# EasyEDA Pro project usb-hub.eprj

# Schematic Schematic1
Board Name: Board1; Create Date: 2026-05-12; Page Name: P1; Project Name: usb-hub; Schematic Name: Schematic1; Update Date: 2026-05-13; Company: EasyEDA.com; Page Size: A4; Version: V1.0
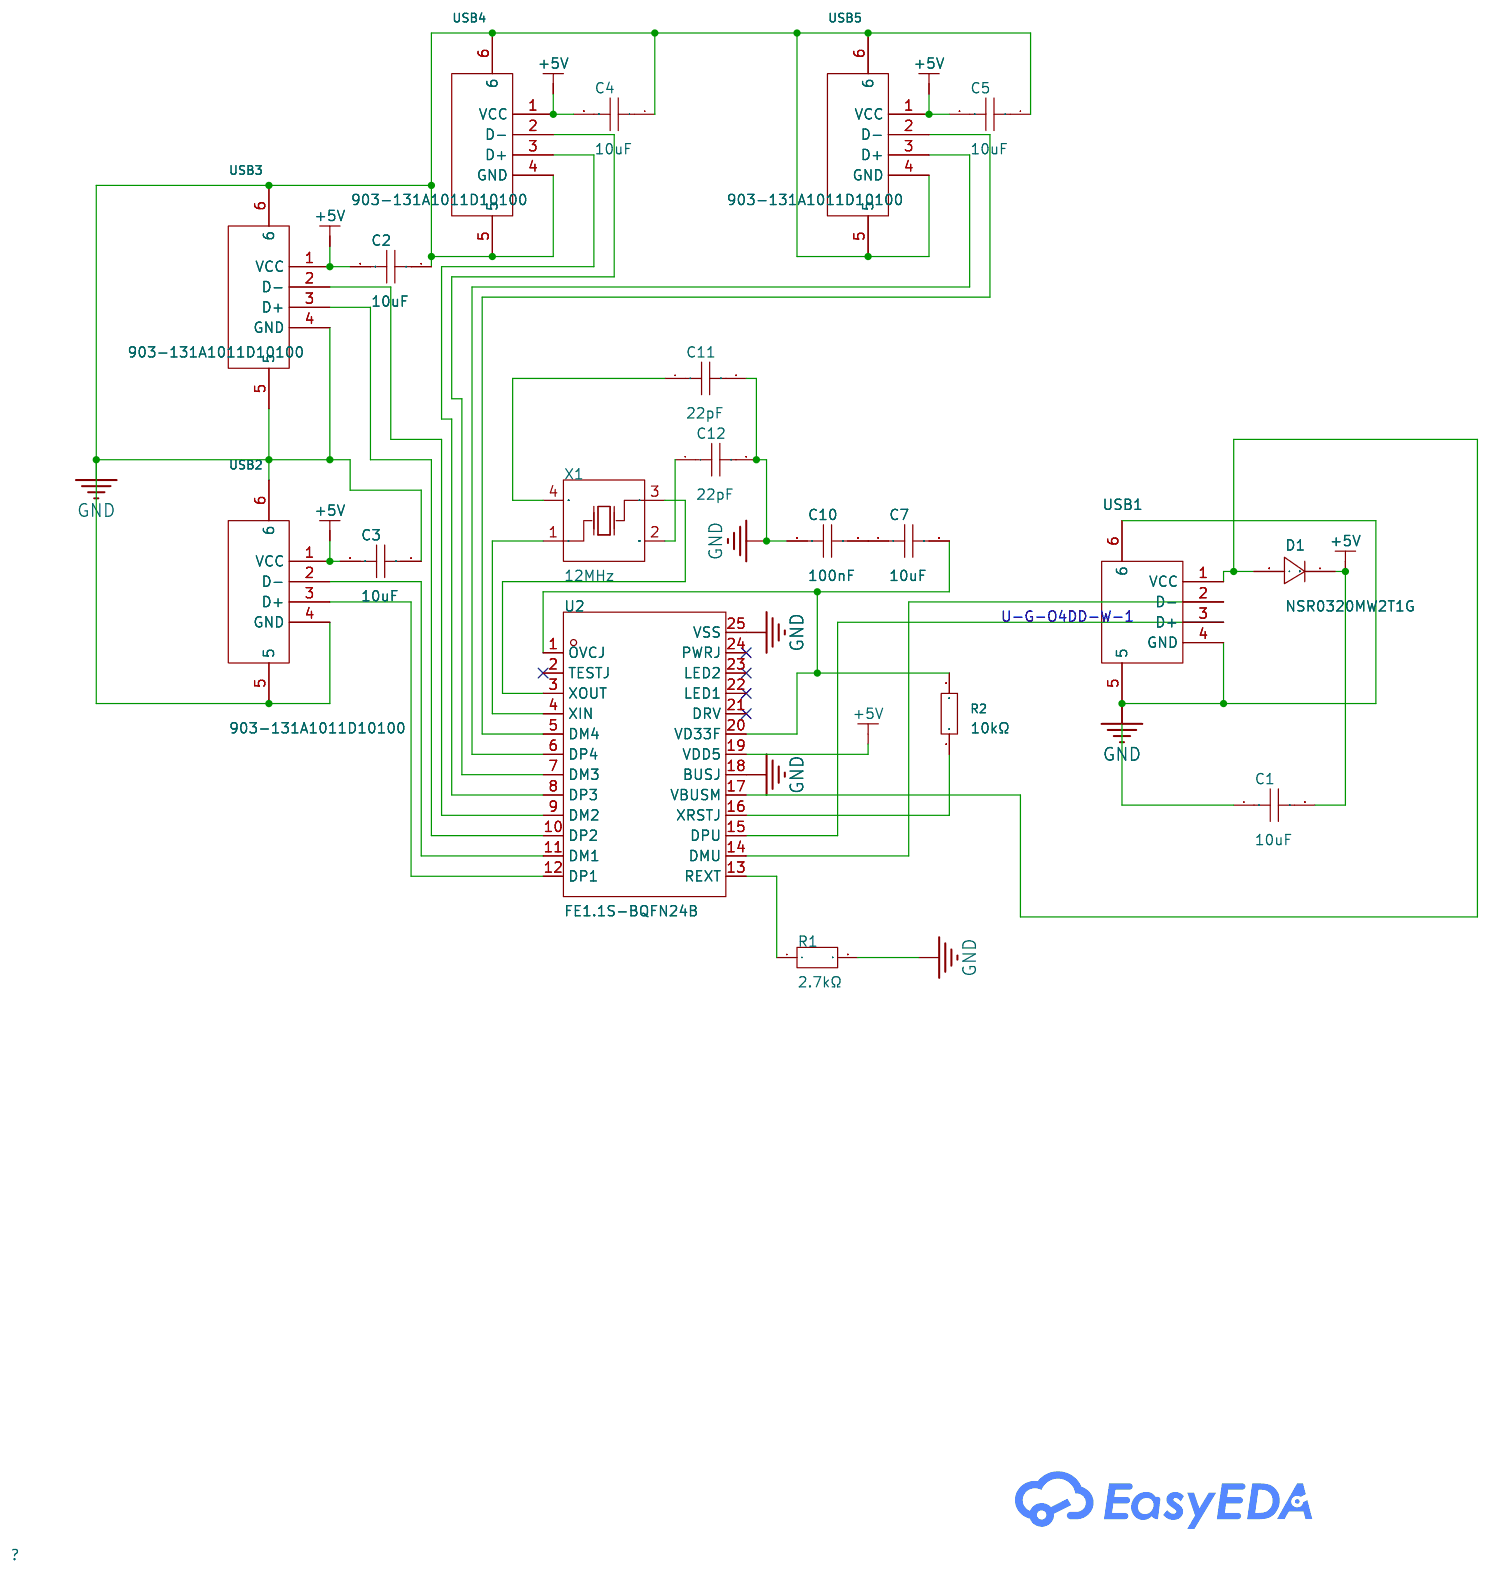
[diagram p0: schematic sheet]

## Parts
C1  10uF  [C0603]
C2  10uF  [C0603]
C3  10uF  [C0603]
C4  10uF  [C0603]
C5  10uF  [C0603]
C7  10uF  [C0603]
C10  100nF  [C0402]
C11  22pF  [CAP-TH_L4.8-W3.2-P5.08-D0.5]
C12  22pF  [CAP-TH_L4.8-W3.2-P5.08-D0.5]
D1  NSR0320MW2T1G  [SOD-323_L1.8-W1.3-LS2.5-RD]
R1  2.7kΩ  [RES-TH_BD1.8-L3.2-P7.20-D0.4]
R2  10kΩ  [R1206]
U2  FE1.1S-BQFN24B  [WQFN-24_L4.0-W4.0-P0.50-TL-EP2.7]
USB1  U-G-O4DD-W-1  [USB-A-TH_U-G-04WD-W-01]
USB2  903-131A1011D10100  [USB-A-TH_C46407]
USB3  903-131A1011D10100  [USB-A-TH_C46407]
USB4  903-131A1011D10100  [USB-A-TH_C46407]
USB5  903-131A1011D10100  [USB-A-TH_C46407]
X1  12MHz  [OSC-SMD_4P-L7.0-W5.0-BL]

## Library data of the parts
C1-C5 C7 = CL10A106KP8NNNC: LCSC Part Name: 10uF ±10% 10V; Supplier Part: C19702; Manufacturer: SAMSUNG(三星); Supplier Footprint: 0603; JLCPCB Part Class: Basic Part; Datasheet: https://item.szlcsc.com/datasheet/CL10A106KP8NNNC/20411.html; Supplier: LCSC; Tolerance: ±10%; Voltage Rating: 10V; Temperature Coefficient: X5R
C10 = CL05B104KO5NNNC: LCSC Part Name: 100nF ±10% 16V; Supplier Part: C1525; Manufacturer: SAMSUNG(三星); Supplier Footprint: 0402; JLCPCB Part Class: Basic Part; Datasheet: https://item.szlcsc.com/datasheet/CL05B104KO5NNNC/1877.html; Supplier: LCSC; Tolerance: ±10%; Voltage Rating: 16V; Temperature Coefficient: X7R
C11 C12 = CC4-0805-CG-50V-22pF-J: LCSC Part Name: 22pF ±5% 50V; Supplier Part: C123150; Manufacturer: TORCH(火炬); Supplier Footprint: 插件,P=5.08mm; JLCPCB Part Class: Extended Part; Datasheet: https://item.szlcsc.com/datasheet/CC4-0805-CG-50V-22pF-J/124420.html; Supplier: LCSC; Tolerance: ±5%; Voltage Rating: 50V
D1 = NSR0320MW2T1G: LCSC Part Name: 电压:20V 电流:1A; Supplier Part: C48192; Manufacturer: onsemi(安森美); Supplier Footprint: SOD-323; JLCPCB Part Class: Extended Part; Datasheet: https://item.szlcsc.com/datasheet/NSR0320MW2T1G/49199.html; Supplier: LCSC; Voltage - Forward(Vf@If): 500mV@900mA; Voltage - DC Reverse(Vr): 20V; Current - Rectified: 1A; Reverse Leakage Current (Ir): 50uA@15V; Operating Junction Temperature Range: -55℃~+125℃; Non-Repetitive Peak Forward Surge Current: 5A
R1 = MF1/8W-2.7KΩ±1%T52: LCSC Part Name: 金属膜电阻 2.7kΩ ±1% 125mW; Supplier Part: C713913; Manufacturer: 华星机电; Supplier Footprint: 插件,D1.8xL3.2mm; JLCPCB Part Class: Extended Part; Datasheet: https://item.szlcsc.com/datasheet/MF1%252F8W-2.7K%25CE%25A9%25C2%25B11%2525T52/754238.html; Supplier: LCSC; Type: Metal Film Resistor; Tolerance: ±1%; Power(Watts): 125mW; Temperature Coefficient: ±200ppm/℃
R2 = 1206W4F1002T5E: LCSC Part Name: 10kΩ ±1% 250mW 厚膜电阻; Supplier Part: C17902; Manufacturer: UNI-ROYAL(厚声); Supplier Footprint: 1206; JLCPCB Part Class: Basic Part; Datasheet: https://item.szlcsc.com/datasheet/1206W4F1002T5E/18590.html; Supplier: LCSC; Type: Thick Film Resistor; Tolerance: ±1%; Power(Watts): 250mW; Voltage-Supply(Max): 200V; Temperature Coefficient: ±100ppm/℃; Operating Temperature: -55℃~+155℃
U2 = FE1.1S-BQFN24B: LCSC Part Name: USB 2.0 4-端口集线器控制器; Supplier Part: C6776948; Manufacturer: TERMINUS; Supplier Footprint: WQFN-24; JLCPCB Part Class: Extended Part; Datasheet: https://item.szlcsc.com/datasheet/FE1.1S-BQFN24B/7735567.html; Supplier: LCSC; Applications Function: USB Hub; USB Protocol: USB 2.0; Number of Channels: 4; Voltage - Supply: 4.5V~5.5V；3V~3.6V; Operating Temperature: 0℃~+70℃; Current - Supply: 84mA; Quiescent Supply Current: 800uA
USB1 = U-G-O4DD-W-1: LCSC Part Name: Type-A 公 沉板; Supplier Part: C98125; Manufacturer: 韩国韩荣; Supplier Footprint: 插件; JLCPCB Part Class: Extended Part; Datasheet: https://item.szlcsc.com/datasheet/U-G-O4DD-W-1/99334.html; Supplier: LCSC; Connector Type: Type-A; Protocol Standard: USB 2.0; Gender: Male; Mounting Type: Laminated board; Number of Contacts: 4P; Number of Ports: 1; Current Rating-Power: 1A; Voltage Rating: 30V; Length: 18.75mm; Detection color: Black
USB2-USB5 = 903-131A1011D10100: LCSC Part Name: Type-A 母 弯插; Supplier Part: C46407; Manufacturer: 精拓金; Supplier Footprint: 插件; JLCPCB Part Class: Extended Part; Datasheet: https://item.szlcsc.com/datasheet/903-131A1011D10100/47411.html; Supplier: LCSC; Connector Type: Type-A; Protocol Standard: USB 2.0; Gender: Female; Mounting Type: Right Angle; Number of Contacts: 4P; Number of Ports: 1; Current Rating-Power: 1.5A; Voltage Rating: 30V; Length: 13.6mm; Detection color: White; Operating Temperature: -35℃~+85℃
X1 = OCETDLJANF-12MHZ: Supplier Part: C295101; Manufacturer: TAITIEN(泰艺电子); Supplier Footprint: SMD7050-4P; JLCPCB Part Class: Extended Part; Datasheet: https://atta.szlcsc.com/upload/public/pdf/source/20180928/C295508_B33E09E3E359617AF2522AD4FD86877F.pdf; Supplier: LCSC; Voltage - Supply: 3.3V; Current - Supply: 10mA; Frequency Stability: ±25ppm; Operating Temperature: -40℃~+85℃

## Nets
+5V: C1.2 C2.2 C3.2 C4.2 C5.2 D1.1(C) U2.19(VDD5) USB2.1(VCC) USB3.1(VCC) USB4.1(VCC) USB5.1(VCC)
GND: C1.1 C2.1 C3.1 C4.1 C5.1 C10.1 C11.2 C12.2 R1.2 U2.18(BUSJ) U2.25(VSS) USB1.4(GND) USB1.5 USB1.6 USB2.4(GND) USB2.5 USB2.6 USB3.4(GND) USB3.5 USB3.6 USB4.4(GND) USB4.5 USB4.6 USB5.4(GND) USB5.5 USB5.6
$1N502: U2.15(DPU) USB1.3(D+)
$1N842: U2.12(DP1) USB2.3(D+)
$1N847: U2.11(DM1) USB2.2(D-)
$1N857: U2.10(DP2) USB3.3(D+)
$1N867: U2.9(DM2) USB3.2(D-)
$1N916: D1.2(A) U2.17(VBUSM) USB1.1(VCC)
$1N1305: U2.8(DP3) USB4.3(D+)
$1N1314: U2.7(DM3) USB4.2(D-)
$1N1535: U2.6(DP4) USB5.3(D+)
$1N1544: U2.5(DM4) USB5.2(D-)
$1N2470: U2.14(DMU) USB1.2(D-)
$1N2587: U2.4(XIN) X1.1(tri)
$1N2685: R1.1 U2.13(REXT)
$1N2885: R2.1 U2.16(XRSTJ)
$1N2949: C7.2 R2.2 U2.1(OVCJ) U2.20(VD33F)
$1N2988: C11.1 X1.4(vdd)
$1N2998: C12.1 X1.2(GND)
$1N3018: U2.3(XOUT) X1.3(out)
$1N3285: C7.1 C10.2

Not connected (* = marked no-connect by the designer): U2 2(TESTJ)* 21(DRV)* 22(LED1)* 23(LED2)* 24(PWRJ)*

# Board PCB1
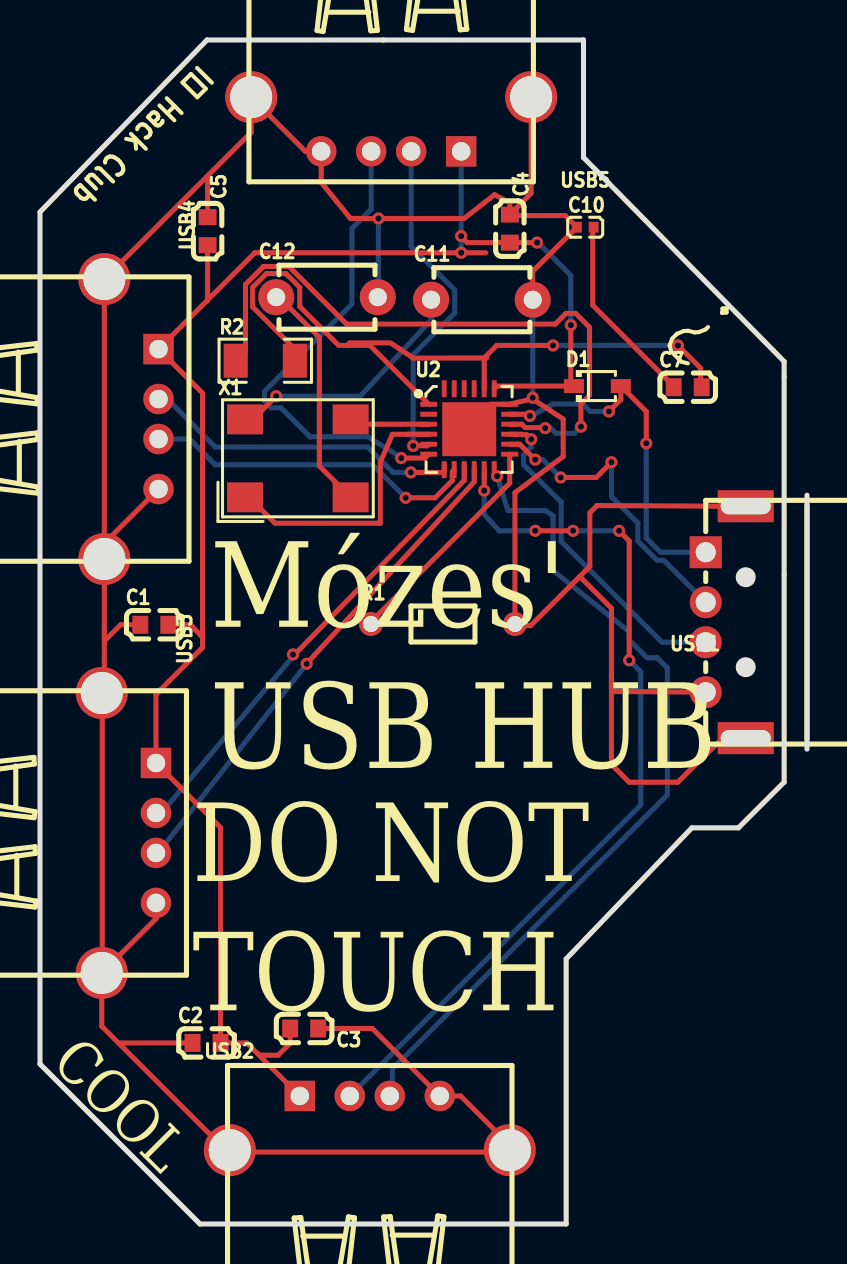
[diagram p1: board, top side]
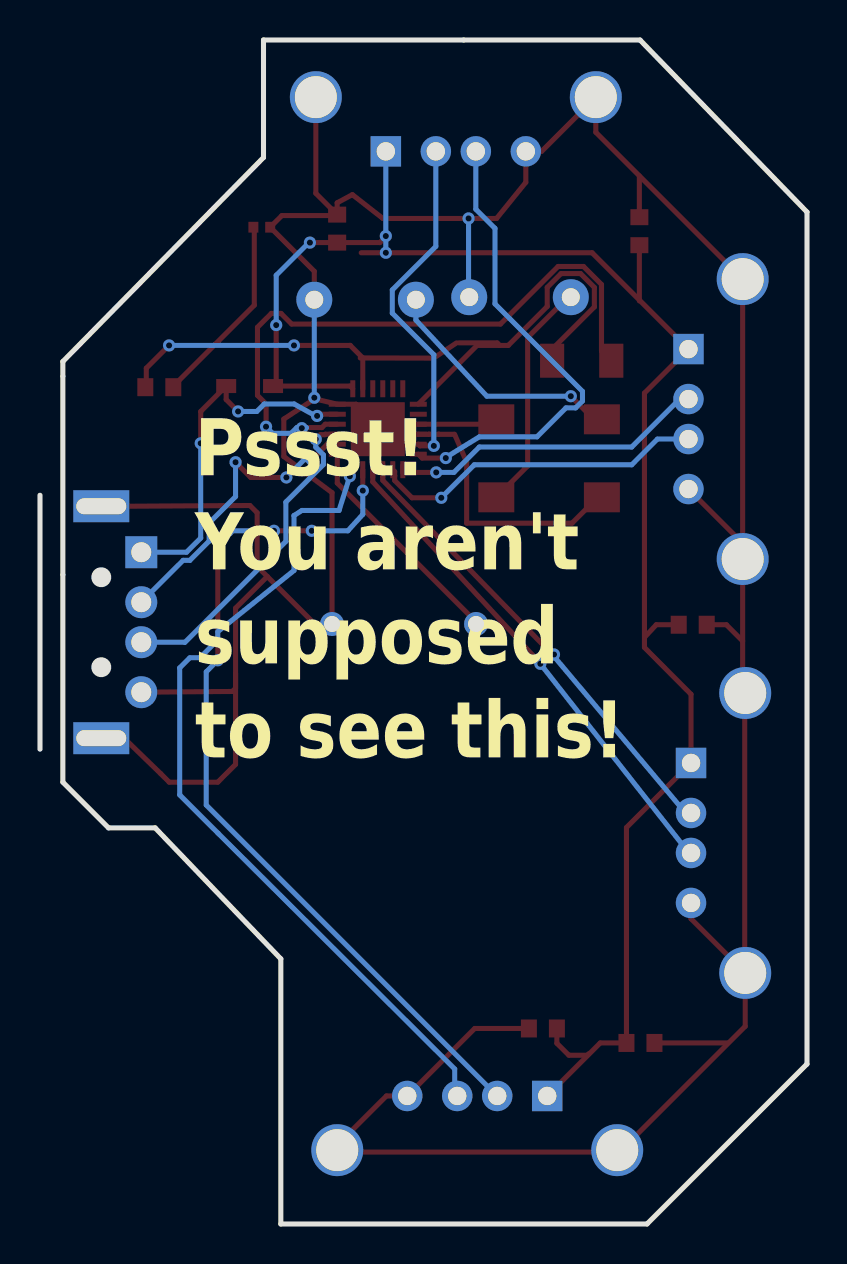
[diagram p2: board, bottom side, seen from below]

Outline 38.35 x 59.22 mm; copper layers: Top Layer, Bottom Layer. Coordinates in mm from the lower left corner of the outline.
Outline path: 0,50.61 8.35,59.22 27.18,59.22 27.18,53.34 37.21,43.14 37.21,22.1 34.93,19.81 32.59,19.81 26.31,13.26 26.31,0 8,0 0,8 0,50.61
Stack: Top Layer 0.035mm / Dielectric1 1.51mm FR4 er 4.5 / Bottom Layer 0.035mm

## Design rules (mm)
template: JLCPCB Capability(Two Layers Board)
spacing copperThickness1oz (default): track to track 0.102, other pairs 0.152 to 0.3
spacing copperThickness2oz: track to track 0.203, other pairs 0.152 to 0.3
track width copperThickness1oz (default): min 0.127, default 0.254, max 2.54
track width copperThickness2oz: min 0.203, default 0.254, max 2.54
differential pair differentialPair (default): width min 0.127, default 0.254, max 2.54; gap min 0.152, default 0.152
via viaSize (default): diameter min 0.5, default 0.61, max 10; hole min 0.3, default 0.305, max 6.3

## Placement (name value [footprint] x y rotation side)
C1  10uF  [C0603]  5.72 29.97 0 top
C2  10uF  [C0603]  8.33 9.06 0 top
C3  10uF  [C0603]  13.21 9.78 180 top
C4  10uF  [C0603]  23.5 49.78 270 top
C5  10uF  [C0603]  8.38 49.66 270 top
C7  10uF  [C0603]  32.39 41.85 0 top
C10  100nF  [C0402]  27.26 49.85 0 top
C11  22pF  [CAP-TH_L4.8-W3.2-P5.08-D0.5]  22.1 46.23 0 top
C12  22pF  [CAP-TH_L4.8-W3.2-P5.08-D0.5]  14.35 46.36 0 top
D1  NSR0320MW2T1G  [SOD-323_L1.8-W1.3-LS2.5-RD]  27.87 41.91 0 top
R1  2.7kΩ  [RES-TH_BD1.8-L3.2-P7.20-D0.4]  20.15 30.01 0 top
R2  10kΩ  [R1206]  11.27 43.18 0 top
U2  FE1.1S-BQFN24B  [WQFN-24_L4.0-W4.0-P0.50-TL-EP2.7]  21.46 39.75 0 top
USB1  U-G-O4DD-W-1  [USB-A-TH_U-G-04WD-W-01]  34.29 30.1 90 top
USB2  903-131A1011D10100  [USB-A-TH_C46407]  16.49 5.05 0 top
USB3  903-131A1011D10100  [USB-A-TH_C46407]  4.44 19.56 270 top
USB4  903-131A1011D10100  [USB-A-TH_C46407]  4.57 40.26 270 top
USB5  903-131A1011D10100  [USB-A-TH_C46407]  17.56 55 180 top
X1  12MHz  [OSC-SMD_4P-L7.0-W5.0-BL]  12.9 38.3 0 top

## Footprints (pads in the part's own frame, mm; a bottom-side part is the same pattern mirrored in y, then rotated)
C0402
  rect 0.5x0.54 smd: 1(-0.42,0) 2(0.42,0)
C0603
  rect 0.8x0.9 smd: 1(-0.7,0) 2(0.7,0)
CAP-TH_L4.8-W3.2-P5.08-D0.5
  round 1.8 hole 0.9: 1(-2.54,0) 2(2.54,0)
OSC-SMD_4P-L7.0-W5.0-BL
  rect 1.8x1.5 smd: 1(-2.64,-1.95) 2(2.64,-1.95) 3(2.64,1.95) 4(-2.64,1.95)
R1206
  rect 1.208x1.701 smd: 1(-1.479,0) 2(1.479,0)
RES-TH_BD1.8-L3.2-P7.20-D0.4
  round 1.2 hole 0.8: 1(-3.6,0) 2(3.6,0)
SOD-323_L1.8-W1.3-LS2.5-RD
  rect 1x0.7 smd: 1(-1.173,0) 2(1.173,0)
USB-A-TH_C46407
  rect 1.524x1.524 hole 0.92: 1(-3.5,1.355)
  round 1.524 hole 0.92: 2(-1,1.355) 3(1,1.355) 4(3.5,1.355)
  round 2.6 hole 2.1: 5(7,-1.355) 6(-7,-1.355)
USB-A-TH_U-G-04WD-W-01
  rect 1.6x1.6 hole 1: 1(3.5,1)
  round 1.6 hole 1: 2(1,1) 3(-1,1) 4(-3.5,1)
  rect 1.6x2.8 hole 0.8x2.5: 5(5.8,-1) 6(-5.8,-1)
WQFN-24_L4.0-W4.0-P0.50-TL-EP2.7
  rect 0.85x0.25 smd: 1(-2.025,1.25) 2(-2.025,0.75) 3(-2.025,0.25) 4(-2.025,-0.25) 5(-2.025,-0.75) 6(-2.025,-1.25) 13(2.025,-1.25) 14(2.025,-0.75) 15(2.025,-0.25) 16(2.025,0.25) 17(2.025,0.75) 18(2.025,1.25)
  rect 0.25x0.85 smd: 7(-1.25,-2.025) 8(-0.75,-2.025) 9(-0.25,-2.025) 10(0.25,-2.025) 11(0.75,-2.025) 12(1.25,-2.025) 19(1.25,2.025) 20(0.75,2.025) 21(0.25,2.025) 22(-0.25,2.025) 23(-0.75,2.025) 24(-1.25,2.025)
  rect 2.7x2.7 smd: 25(0.001,0)

## Nets
As in the schematic.

Pads without a net: U2 2 21 22 23 24

## Via types
v1: diameter 0.61, hole 0.305, Top Layer to Bottom Layer, 30 vias

## Routing (per net, layer and track width the routed paths; a pad name or vN(x,y) marks a point on that pad's centre or on a via; arc(x,y) is an arc through that point)
+5V: length 89.7
  Top Layer w0.254: C1.2 7.54,29.97 8.13,29.34 ; C5.2 8.38,46.17 ; 22.29,48.58 10.74,48.58 USB4.1 8.13,41.56 8.13,28.83 5.8,26.5 USB3.1 9.03,19.83 C2.2 10.34,9.06 USB2.1 ; 10.92,8.51 10.99,8.44 11.91,8.44 12.51,9.04 C3.2 ; 21.06,49.38 21.36,49.08 C4.2 v1(24.86,49.08) ; U2.19 22.85,41.91 D1.1 26.54,42.07 v1(26.54,44.96)
  Bottom Layer w0.254: 21.06,53.65 21.06,48.61 ; 24.86,49.13 26.54,47.45 v1(26.54,44.96)
  vias: v1(21.06,49.41) v1(21.06,48.58)
GND: length 196.7
  Top Layer w0.254: USB3.5 3.09,9.89 9.38,3.6 23.58,3.6 23.62,3.56 ; USB3.5 5.8,15.27 USB3.4 ; USB3.5 3.12,12.58 3.12,26.67 3.22,26.77 USB4.5 ; USB4.4 3.22,34.05 USB4.6 10.56,54.6 USB5.5 13.27,53.65 14.06,53.65 14.06,52.1 15.52,50.29 21.21,50.29 22.73,51.48 23.5,51.07 C4.1 24.56,51.55 USB5.6 ; 3.22,29.16 4.03,29.97 C1.1 ; C2.1 4,9.06 ; C5.1 8.38,52.41 ; C3.1 16.62,9.78 USB2.4 21.03,6.4 23.6,3.83 ; 21.72,39.37 21.59,39.5 21.59,40.04 22.55,41 U2.18 24.63,41.28 ; 23.5,50.43 26.26,50.43 C10.1 24.64,47.65 C11.2 ; 23.75,30.1 23.75,36.58 26.16,38.39 26.16,40.26 24.64,41.25 ; 23.75,29.93 24.53,29.93 26.99,32.39 ; 26.99,32.39 28.57,30.8 28.57,22.99 29.46,22.1 31.89,22.1 32.32,22.52 34.15,24.3 USB1.6 ; 26.99,32.39 27.5,32.89 27.5,35.58 27.86,35.93 34.15,35.9 ; 28.57,27.54 28.57,26.8 28.74,26.63 USB1.4
  Bottom Layer w0.254: v1(16.92,50.29) 16.92,46.39 C12.2 ; C11.2 24.64,41.25
  vias: v1(24.64,41.33)
$1N502: length 16.6
  Top Layer w0.254: v1(24.56,39.25) 24.34,39.48 24.11,39.48 24.09,39.5 U2.15
  Bottom Layer w0.254: 31.12,29.1 USB1.3 ; 31.12,29.08 26.06,34.14 26.06,36.11 24.18,37.98 24.18,38.47 24.56,38.85 v1(24.56,39.25)
$1N842: length 41.9
  Bottom Layer w0.254: 17.62,6.28 17.62,7.75 29.45,19.54 31.37,21.46 31.37,27.81 30.86,28.32 30.35,28.32 29.46,29.21 29.46,29.62 25.65,32.68 25.65,35.43 25.26,35.69 23.4,35.69 v1(22.86,37.4)
$1N847: length 44
  Top Layer w0.254: v1(22.21,36.68) U2.11 ; v1(26.65,34.67) v1(24.76,34.67) ; v1(28.96,34.67) 29.46,34.16 v1(29.46,28.19)
  Bottom Layer w0.254: USB2.2 30.04,20.95 30.04,27.62 v1(29.46,28.19) ; 22.21,36.55 22.21,35.49 22.96,34.67 v1(24.76,34.67) ; v1(28.96,34.67) v1(26.65,34.67)
$1N857: length 25
  Top Layer w0.254: v1(13.34,28.02) 13.72,28.45 21.71,37.12 21.71,37.76
  Bottom Layer w0.254: 5.91,18.56 v1(13.34,28.02)
$1N867: length 23.3
  Top Layer w0.254: 12.7,28.45 21.21,37.19 21.21,37.95
  Bottom Layer w0.254: 6.05,20.54 12.7,28.45
  vias: v1(12.65,28.48)
$1N916: length 18.3
  Top Layer w0.254: v1(28.45,40.64) 29.04,41.24 D1.2 30.32,40.64 v1(30.32,39.05) ; U2.17 24.41,40.5 v1(24.5,40.42)
  Bottom Layer w0.254: 24.37,40.31 25.65,41.01 27.14,41.01 27.51,40.64 28.34,40.64 ; v1(30.32,39.05) 30.32,34.31 31.03,33.6 USB1.1
$1N1305: length 16.8
  Top Layer w0.254: U2.8 20.62,37.63 20.62,37.42 20.62,37.42 20.62,37.19 19.75,36.32 v1(18.29,36.32)
  Bottom Layer w0.254: v1(18.29,36.32) 16.64,37.97 8.76,37.97 7.48,39.26 USB4.3
$1N1314: length 16.2
  Top Layer w0.254: v1(18.54,37.59) 20.21,37.59 20.21,37.95
  Bottom Layer w0.254: USB4.2 6.37,41.26 8.76,38.86 16.38,38.86 17.65,37.59 v1(18.54,37.59)
$1N1535: length 24
  Top Layer w0.254: v1(18.06,38.31) 19.25,38.31 U2.6
  Bottom Layer w0.254: 18.03,38.35 16.38,39.37 13.5,39.37 12.05,40.82 11.57,40.82 11.23,41.16 11.23,41.64 15.6,46.02 15.6,49.8 16.56,50.75 USB5.3
$1N1544: length 17.3
  Top Layer w0.254: v1(18.66,38.92) 19.35,38.92 U2.5
  Bottom Layer w0.254: USB5.2 18.56,48.89 20.74,46.72 20.74,45.56 18.66,43.48 v1(18.66,38.92)
$1N2470: length 15.2
  Top Layer w0.254: v1(28.57,38.1) 27.81,37.34 v1(26.03,37.34) ; v1(24.76,38.23) 24.33,38.67 24.32,38.67 23.99,39 U2.14
  Bottom Layer w0.254: v1(24.76,38.23) 25.15,38.23 v1(26.03,37.34) ; v1(28.57,38.1) 28.57,36.38 29.9,35.06 29.9,34.16 30.86,33.19 31.2,33.19 USB1.2
$1N2587: length 13.6
  Top Layer w0.254: 10.36,36.45 11.75,35.05 17.02,35.05 17.02,38.1 17.62,39.5 ; 17.65,39.5 18.41,39.5 18.42,39.5 18.9,39.5 18.91,39.5 19.43,39.5 U2.4
$1N2885: length 32.8
  Top Layer w0.254: U2.16 24.09,40 24.26,39.83 25.23,39.83 v1(25.26,39.8) ; v1(27.05,39.88) 27.05,39.88 27.05,41.01 27.48,41.44 27.48,44.85 26.78,45.54 26.3,45.54 25.77,45.01 15.33,45.01 12.45,47.89 11.18,47.89 10.28,46.99 10.28,43.67 R2.1
  Bottom Layer w0.254: v1(25.26,39.8) 25.05,39.8 25.03,39.83 25.51,39.83 25.8,39.55 26.72,39.55 v1(27.05,39.88)
$1N2949: length 38.1
  Top Layer w0.254: 15.37,43.94 15.49,44.07 17.4,44.07 ; 15.37,43.94 16.5,43.94 U2.1 ; 15.37,43.94 14.94,43.94 12.99,45.89 12.99,46.84 12.3,47.53 11.32,47.53 10.63,46.84 10.63,45.87 12.74,43.75 R2.2 ; 17.53,44.07 18.67,43.31 22.34,43.32 ; 22.21,41.75 22.21,43.32 22.84,43.94 v1(25.65,43.94) ; v1(31.9,43.94) 33.04,42.8 33.04,41.85
  Bottom Layer w0.254: v1(31.9,43.94) v1(25.65,43.94)
$1N2988: length 12.5
  Top Layer w0.254: X1.4 10.66,40.25 v1(11.81,41.4)
  Bottom Layer w0.254: v1(11.81,41.4) 16.01,41.4 19.56,45.21 C11.1
$1N2685: length 11.3
  Top Layer w0.254: U2.13 23.49,37.06 16.55,30.12
$1N2998: length 11.5
  Top Layer w0.254: 11.81,46.49 13.97,44.33 13.97,37.91 15.44,36.45
$1N3018: length 4
  Top Layer w0.254: X1.3 15.78,40 U2.3
$1N3285: length 9.7
  Top Layer w0.254: 27.64,49.85 27.64,45.95 31.74,41.85

## Text on the board
Bottom Silkscreen Layer: Pssst! / You aren't / supposed / to see this!
Top Silkscreen Layer: Mózes' / USB HUB | COOL | I❤️ Hack Club | 🚓 | DO NOT / TOUCH
